# EAGLE schematic urov schematic_2 (EAGLE 7.5.0)
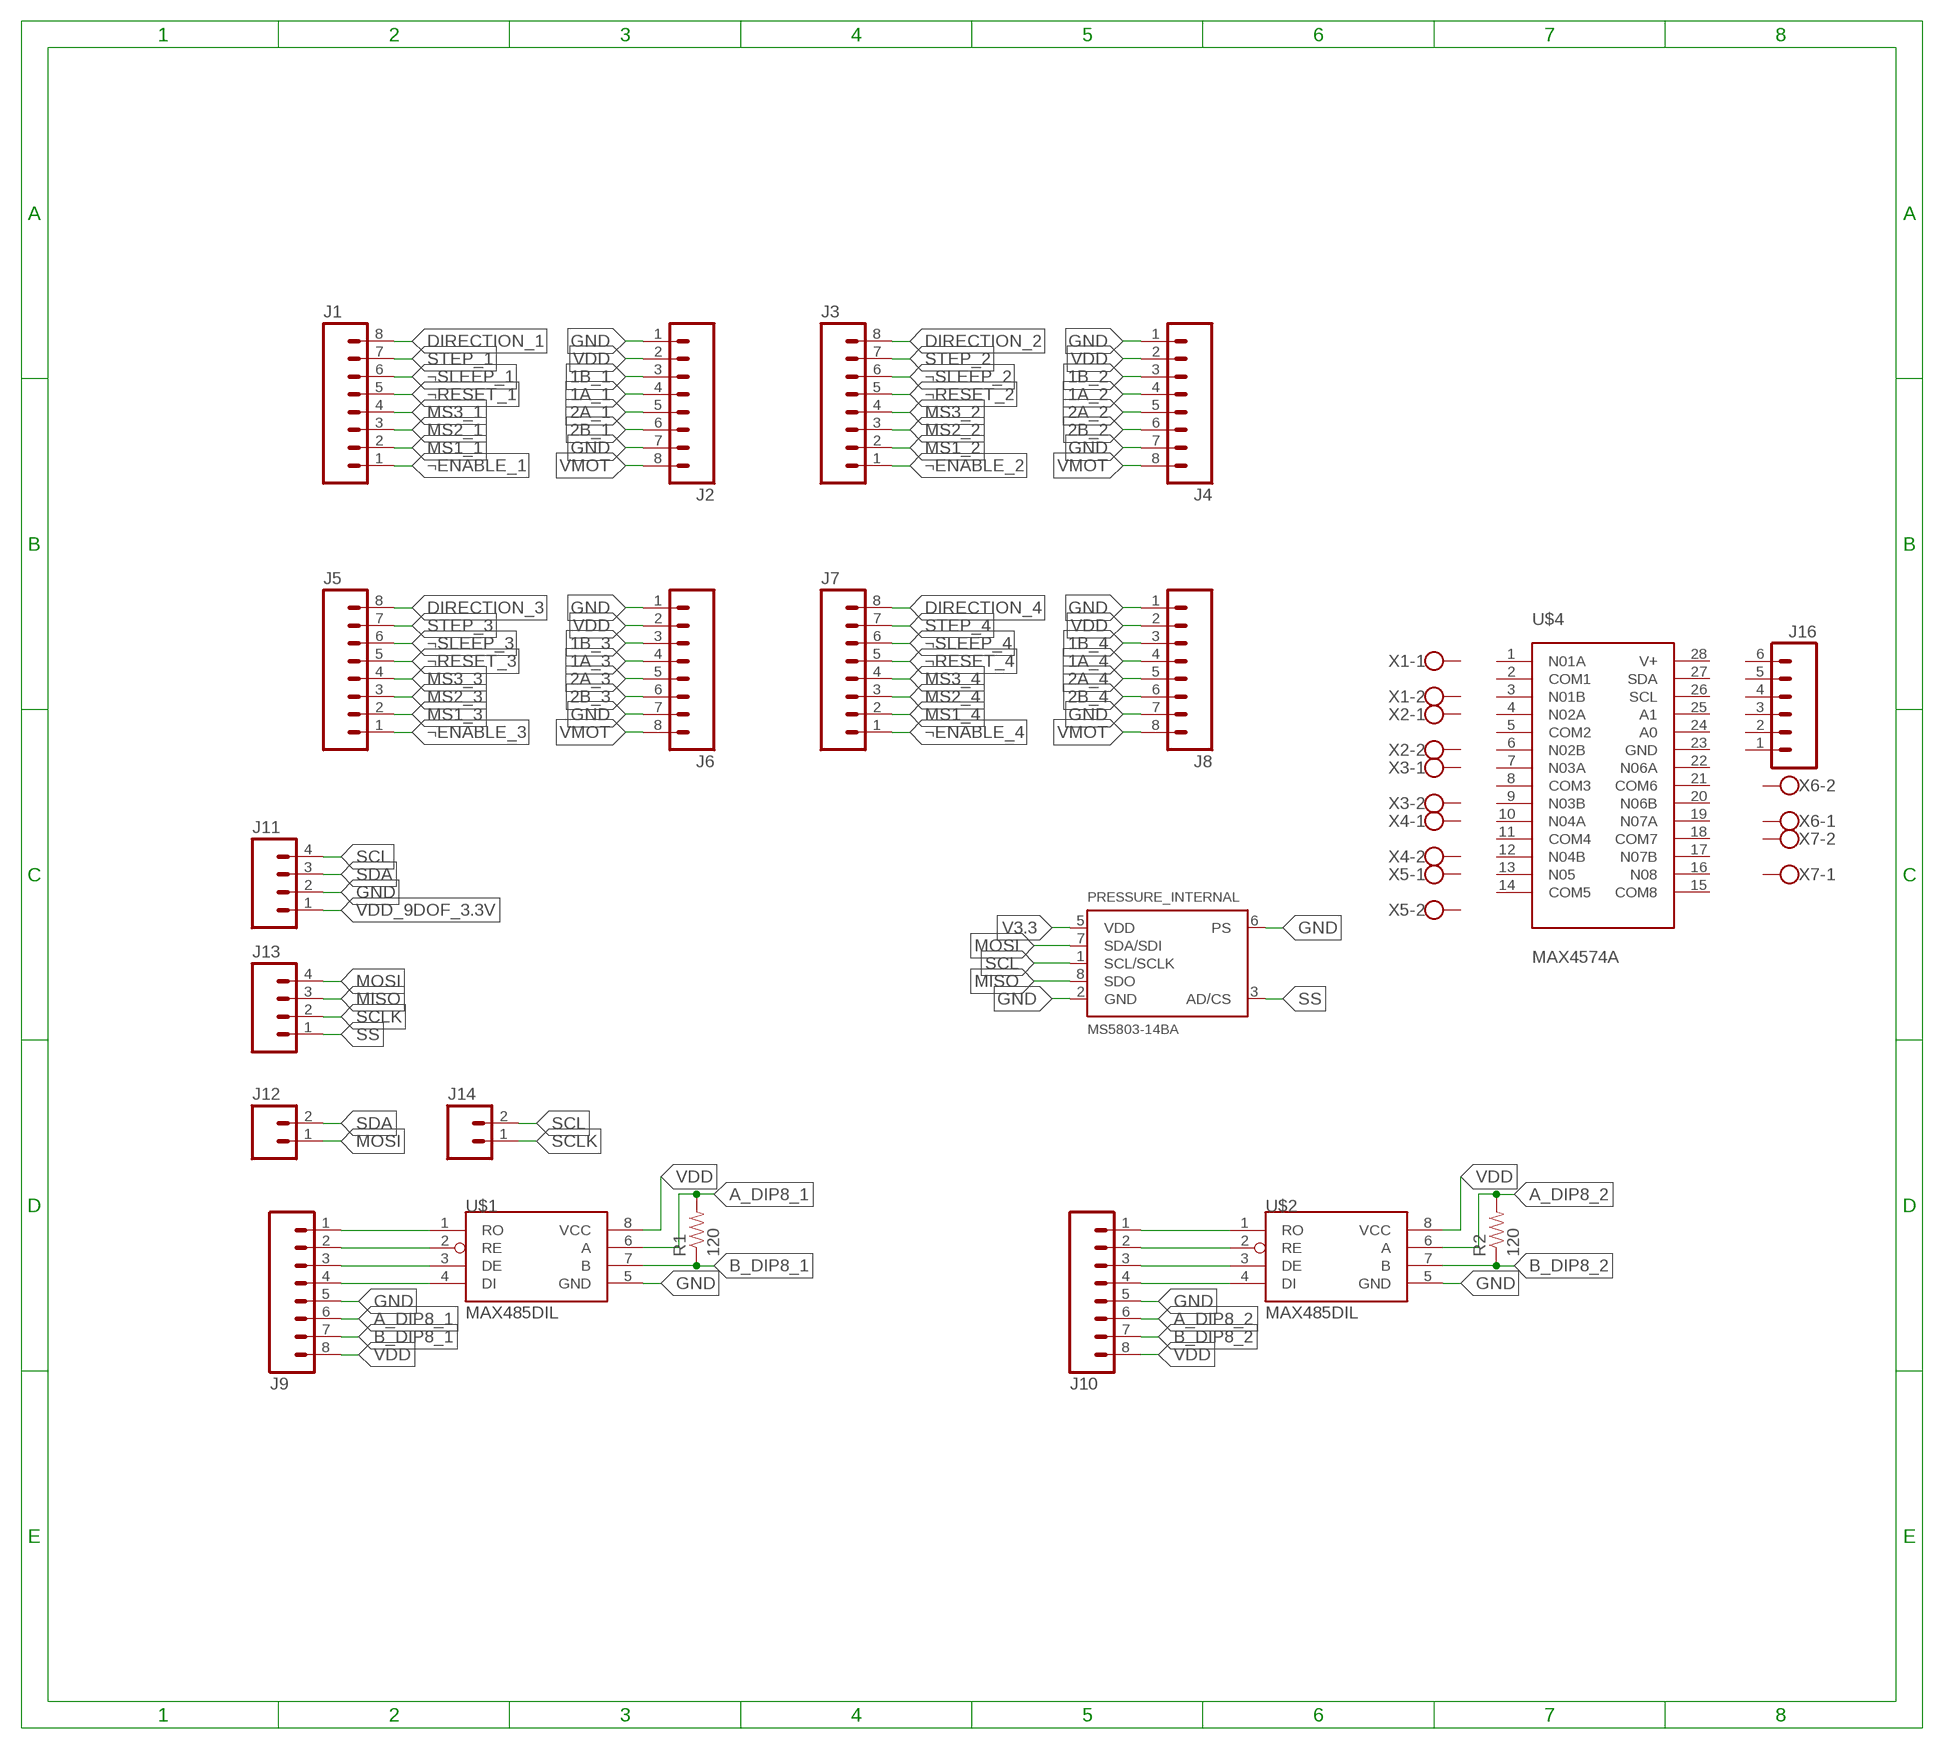
[diagram p0: schematic, sheet 1]

## Parts
J1  M08  [1X08_ROUND]
J2  M08  [1X08_ROUND]
J3  M08  [1X08_ROUND]
J4  M08  [1X08_ROUND]
J5  M08  [1X08_ROUND]
J6  M08  [1X08_ROUND]
J7  M08  [1X08_ROUND]
J8  M08  [1X08_ROUND]
J9  M08  [1X08_ROUND]
J10  M08  [1X08_ROUND]
J11  M04PTH  [1X04]
J12  M02PTH  [1X02]
J13  M04PTH  [1X04]
J14  M02PTH  [1X02]
J16  M06POGOPIN_HOLES_ONLY  [1X06_HOLES_ONLY]
PRESSURE_INTERNAL  MS5803-14BA  [MS5803]
R1  120  RESISTOR0805-RES  [0805]
R2  120  RESISTOR0805-RES  [0805]
U$1  MAX485DIL  [DIL08]
U$2  MAX485DIL  [DIL08]
U$4  MAX4574A  [28-SSOP]
X1  W237-102  [W237-102]
X2  W237-102  [W237-102]
X3  W237-102  [W237-102]
X4  W237-102  [W237-102]
X5  W237-102  [W237-102]
X6  W237-102  [W237-102]
X7  W237-102  [W237-102]

## Nets
1A_1: J2.4
1A_2: J4.4
1A_3: J6.4
1A_4: J8.4
1B_1: J2.3
1B_2: J4.3
1B_3: J6.3
1B_4: J8.3
2A_1: J2.5
2A_2: J4.5
2A_3: J6.5
2A_4: J8.5
2B_1: J2.6
2B_2: J4.6
2B_3: J6.6
2B_4: J8.6
A_DIP8_1: J9.6 R1.2 U$1.6(A)
A_DIP8_2: J10.6 R2.2 U$2.6(A)
B_DIP8_1: J9.7 R1.1 U$1.7(B)
B_DIP8_2: J10.7 R2.1 U$2.7(B)
DIRECTION_1: J1.8
DIRECTION_2: J3.8
DIRECTION_3: J5.8
DIRECTION_4: J7.8
GND: J2.1 J2.7 J4.1 J4.7 J6.1 J6.7 J8.1 J8.7 J9.5 J10.5 J11.2 PRESSURE_INTERNAL.2(GND) PRESSURE_INTERNAL.6(PS) U$1.5(GND) U$2.5(GND)
MISO: J13.3 PRESSURE_INTERNAL.8(SDO)
MOSI: J12.1 J13.4 PRESSURE_INTERNAL.7(SDA/SDI)
MS1_1: J1.2
MS1_2: J3.2
MS1_3: J5.2
MS1_4: J7.2
MS2_1: J1.3
MS2_2: J3.3
MS2_3: J5.3
MS2_4: J7.3
MS3_1: J1.4
MS3_2: J3.4
MS3_3: J5.4
MS3_4: J7.4
N$1: J9.1 U$1.1(RO)
N$2: J9.2 U$1.2(RE)
N$3: J9.3 U$1.3(DE)
N$4: J9.4 U$1.4(DI)
N$10: J10.1 U$2.1(RO)
N$11: J10.2 U$2.2(RE)
N$13: J10.3 U$2.3(DE)
N$14: J10.4 U$2.4(DI)
SCL: J11.4 J14.2 PRESSURE_INTERNAL.1(SCL/SCLK)
SCLK: J13.2 J14.1
SDA: J11.3 J12.2
SS: J13.1 PRESSURE_INTERNAL.3(AD/CS)
STEP_1: J1.7
STEP_2: J3.7
STEP_3: J5.7
STEP_4: J7.7
V3.3: PRESSURE_INTERNAL.5(VDD)
VDD: J2.2 J4.2 J6.2 J8.2 J9.8 J10.8 U$1.8(VCC) U$2.8(VCC)
VDD_9DOF_3.3V: J11.1
VMOT: J2.8 J4.8 J6.8 J8.8
¬ENABLE_1: J1.1
¬ENABLE_2: J3.1
¬ENABLE_3: J5.1
¬ENABLE_4: J7.1
¬RESET_1: J1.5
¬RESET_2: J3.5
¬RESET_3: J5.5
¬RESET_4: J7.5
¬SLEEP_1: J1.6
¬SLEEP_2: J3.6
¬SLEEP_3: J5.6
¬SLEEP_4: J7.6
Unconnected: J16.1 J16.2 J16.3 J16.4 J16.5 J16.6 U$4.1(N01A) U$4.2(COM1) U$4.3(N01B) U$4.4(N02A) U$4.5(COM2) U$4.6(N02B) U$4.7(N03A) U$4.8(COM3) U$4.9(N03B) U$4.10(N04A) U$4.11(COM4) U$4.12(N04B) U$4.13(N05) U$4.14(COM5) U$4.15(COM8) U$4.16(N08) U$4.17(N07B) U$4.18(COM7) U$4.19(N07A) U$4.20(N06B) U$4.21(COM6) U$4.22(N06A) U$4.23(GND) U$4.24(A0) U$4.25(A1) U$4.26(SCL) U$4.27(SDA) U$4.28(V+) X1.1 X1.2 X2.1 X2.2 X3.1 X3.2 X4.1 X4.2 X5.1 X5.2 X6.1 X6.2 X7.1 X7.2

## Library data of the parts
J1-J10 = SparkFun-Connectors:M08: Header 8 Standard 8-pin 0.1" header. Use with straight break away headers (SKU : PRT-00116), right angle break away headers (PRT-00553), swiss pins (PRT-00743), machine pins (PRT-00117), and female headers (PRT-00115).; PROD_ID: CONN-08437
J11 J13 = SparkFun-Connectors:M04: Header 4 Standard 4-pin 0.1" header. Use with straight break away headers (SKU : PRT-00116), right angle break away headers (PRT-00553), swiss pins (PRT-00743), machine pins (PRT-00117), and female headers (PRT-00115). Molex polarized connector foot print use with SKU : PRT-08231 with associated crimp pins and housings. 1MM SMD Version SKU: PRT-10208; PROD_ID: CONN-09696
J12 J14 = SparkFun-Connectors:M02: Standard 2-pin 0.1" header. Use with - straight break away headers ( PRT-00116) - right angle break away headers (PRT-00553) - swiss pins (PRT-00743) - machine pins (PRT-00117) - female headers (PRT-00115) Molex polarized connector foot print use with: PRT-08233 with associated crimp pins and housings. 2.54_SCREWTERM for use with PRT-10571. 3.5mm Screw Terminal footprints for PRT-08084 5mm Screw Terminal footprints for use with PRT-08432
J16 = SparkFun-Connectors:M06: Header 6 Standard 6-pin 0.1" header. Use with straight break away headers (SKU : PRT-00116), right angle break away headers (PRT-00553), swiss pins (PRT-00743), machine pins (PRT-00117), and female headers (PRT-00115). Molex polarized connector foot print use with SKU : PRT-08094 with associated crimp pins and housings. NOTES ON THE VARIANTS LOCK and LOCK_LONGPADS... This footprint was designed to help hold the alignment of a through-hole component (i.e. 6-pin header) while soldering it into place. You may notice that each hole has been shifted either up or down by 0.005 of an inch from it's more standard position (which is a perfectly straight line). This slight alteration caused the pins (the squares in the middle) to touch the edges of the holes. Because they are alternating, it causes a "brace" to hold the component in place. 0.005 has proven to be the perfect amount of "off-center" position when using our standard breakaway headers. Although looks a little odd when you look at the bare footprint, once you have a header in there, the alteration is very hard to notice. Also,if you push a header all the way into place, it is covered up entirely on the bottom side. This idea of altering the position of holes to aid alignment will be further integrated into the Sparkfun Library for other footprints. It can help hold any component with 3 or more connection pins.; PROD_ID: CONN-08437
PRESSURE_INTERNAL = SparkFun-Sensors:MS5803-14BA: Measurement Specialties MS5803_14BA Pressure (Depth) Sensor Datasheet: https://cdn.sparkfun.com/datasheets/Sensors/Weather/ms5803_14ba.pdf; PROD_ID: IC-12111
R1 R2 = SparkFun-Passives:RESISTOR: Resistor Basic schematic elements and footprints for 0603, 1206, and PTH resistors.
U$1 U$2 = SparkFun-DigitalIC:MAX485: RS-485 transceiver
U$4 = UROV_Accessories:MAX4574
X1-X7 = con-wago-500:W237-102: WAGO SCREW CLAMP; MPN: 237-102; OC_FARNELL: unknown; OC_NEWARK: 70K9898